# Altium project FMC_ADC_250M_16B_4ch.PrjPCB (part 4 of 4)

## Sheet ADC_Buffers.SchDoc
size A3
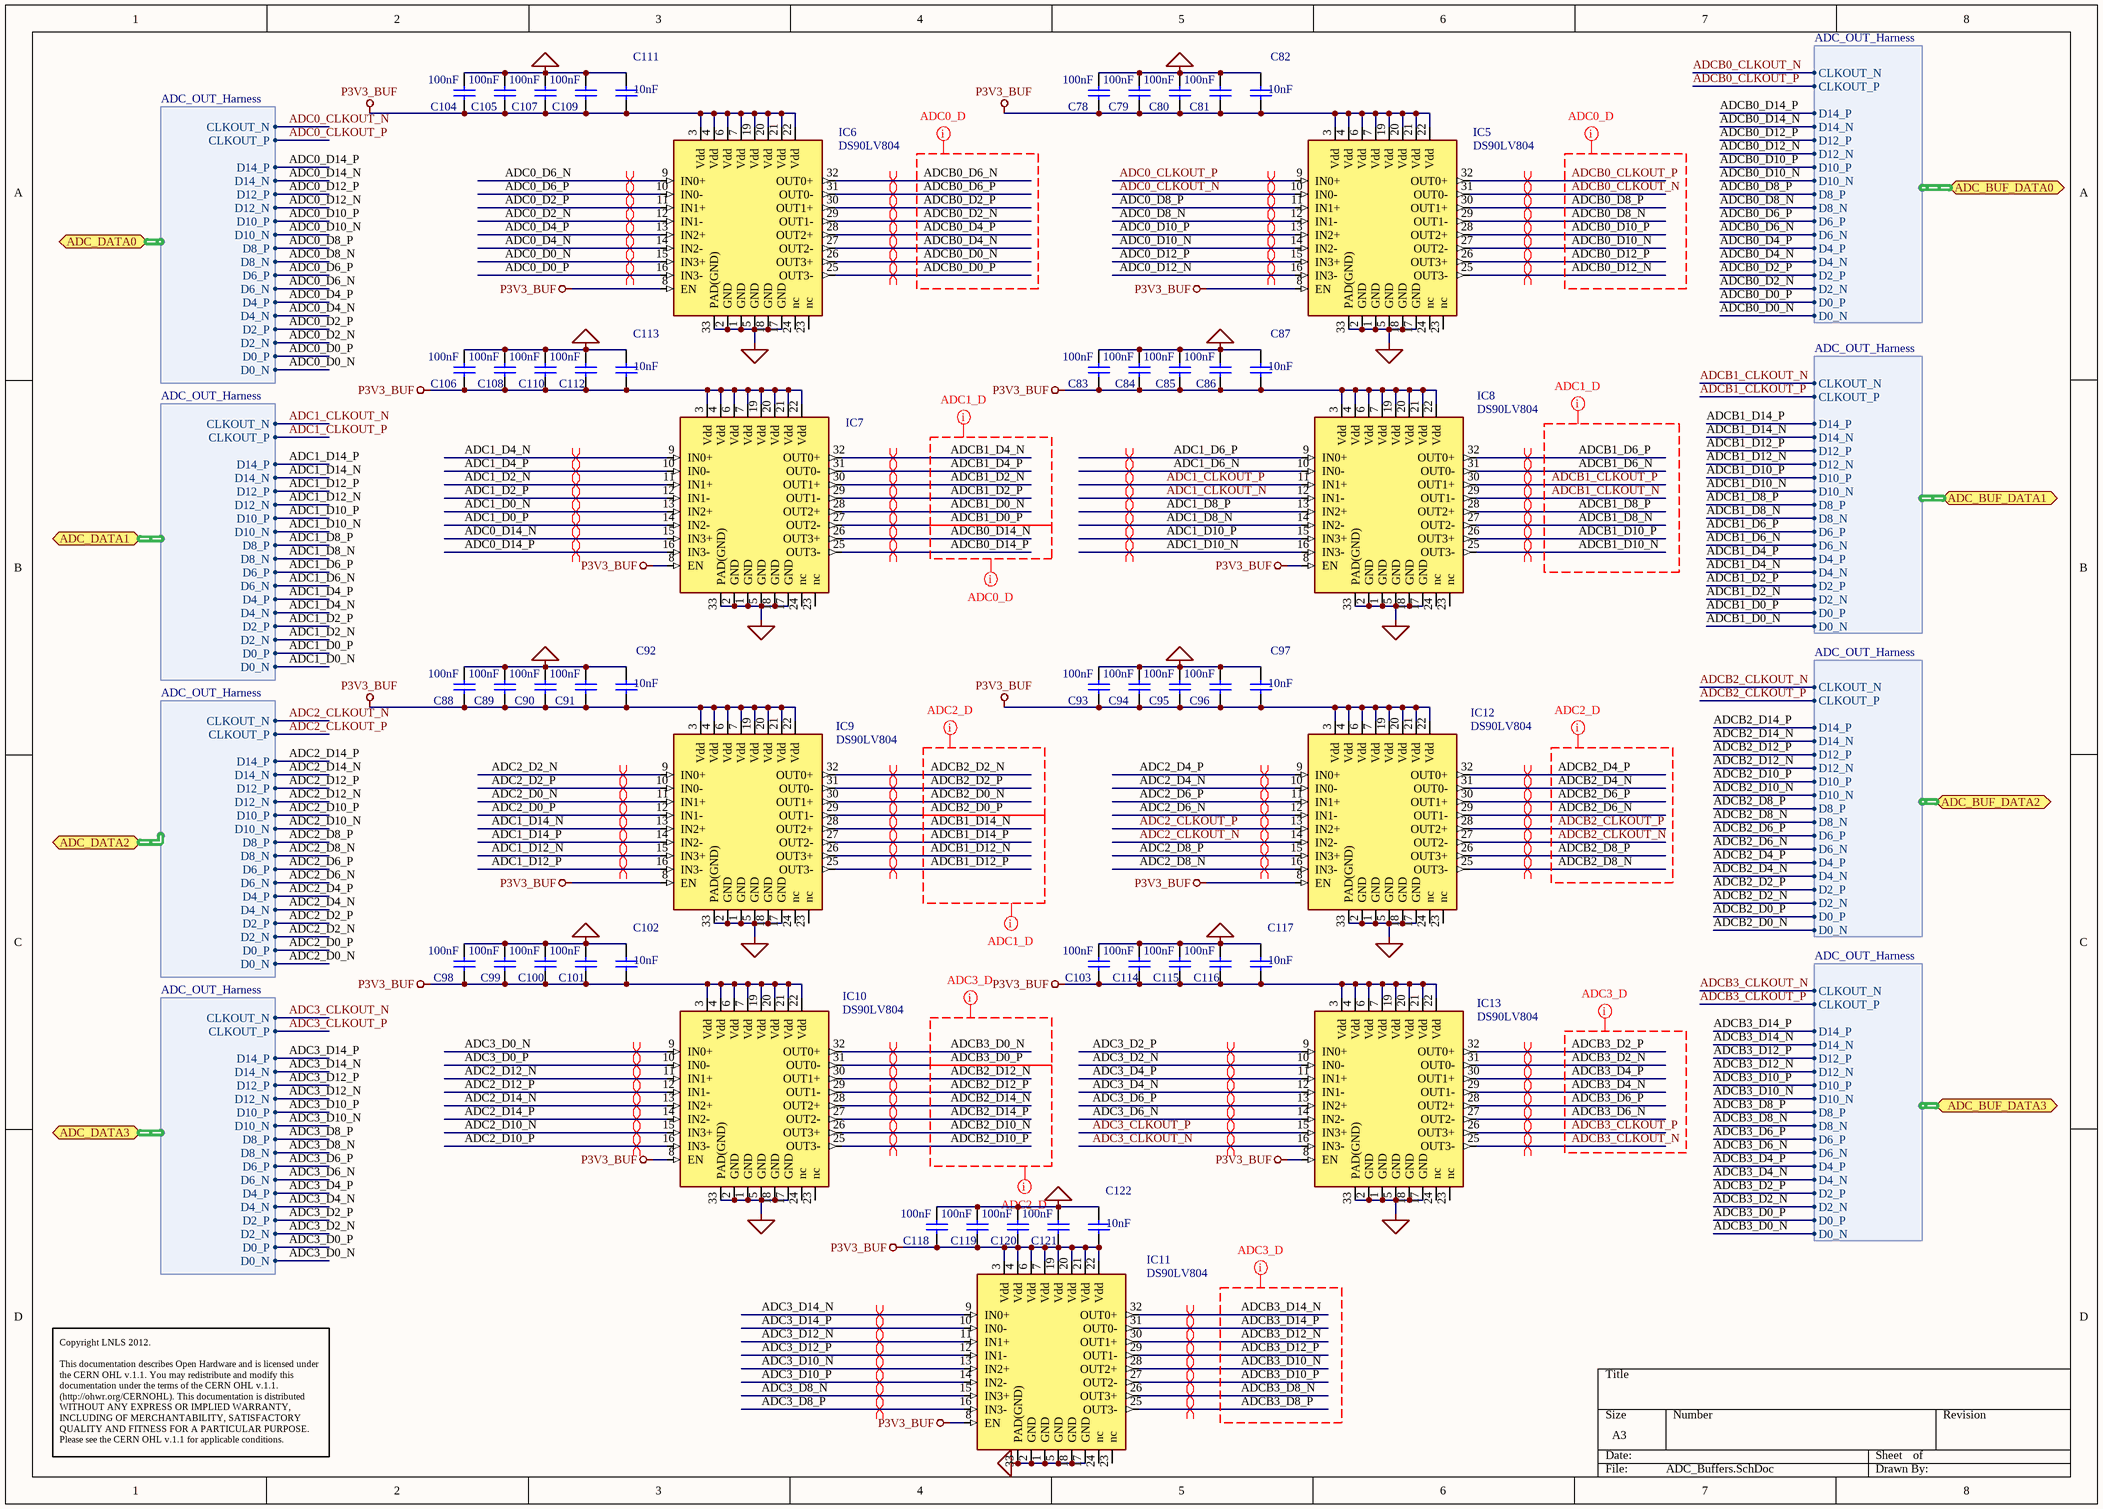
[diagram p6: ADC_Buffers.SchDoc]

### Parts
C78  100nF  [CAPC0603X33N]
C79  100nF  [CAPC0603X33N]
C80  100nF  [CAPC0603X33N]
C81  100nF  [CAPC0603X33N]
C82  10nF  [CAPC0603X33N]
C83  100nF  [CAPC0603X33N]
C84  100nF  [CAPC0603X33N]
C85  100nF  [CAPC0603X33N]
C86  100nF  [CAPC0603X33N]
C87  10nF  [CAPC0603X33N]
C88  100nF  [CAPC0603X33N]
C89  100nF  [CAPC0603X33N]
C90  100nF  [CAPC0603X33N]
C91  100nF  [CAPC0603X33N]
C92  10nF  [CAPC0603X33N]
C93  100nF  [CAPC0603X33N]
C94  100nF  [CAPC0603X33N]
C95  100nF  [CAPC0603X33N]
C96  100nF  [CAPC0603X33N]
C97  10nF  [CAPC0603X33N]
C98  100nF  [CAPC0603X33N]
C99  100nF  [CAPC0603X33N]
C100  100nF  [CAPC0603X33N]
C101  100nF  [CAPC0603X33N]
C102  10nF  [CAPC0603X33N]
C103  100nF  [CAPC0603X33N]
C104  100nF  [CAPC0603X33N]
C105  100nF  [CAPC0603X33N]
C106  100nF  [CAPC0603X33N]
C107  100nF  [CAPC0603X33N]
C108  100nF  [CAPC0603X33N]
C109  100nF  [CAPC0603X33N]
C110  100nF  [CAPC0603X33N]
C111  10nF  [CAPC0603X33N]
C112  100nF  [CAPC0603X33N]
C113  10nF  [CAPC0603X33N]
C114  100nF  [CAPC0603X33N]
C115  100nF  [CAPC0603X33N]
C116  100nF  [CAPC0603X33N]
C117  10nF  [CAPC0603X33N]
C118  100nF  [CAPC0603X33N]
C119  100nF  [CAPC0603X33N]
C120  100nF  [CAPC0603X33N]
C121  100nF  [CAPC0603X33N]
C122  10nF  [CAPC0603X33N]
IC5  DS90LV804  [QFN50P500X500X80-33N-S320]
IC6  DS90LV804  [QFN50P500X500X80-33N-S320]
IC7  DS90LV804  [QFN50P500X500X80-33N-S320]  (value not drawn)
IC8  DS90LV804  [QFN50P500X500X80-33N-S320]
IC9  DS90LV804  [QFN50P500X500X80-33N-S320]
IC10  DS90LV804  [QFN50P500X500X80-33N-S320]
IC11  DS90LV804  [QFN50P500X500X80-33N-S320]
IC12  DS90LV804  [QFN50P500X500X80-33N-S320]
IC13  DS90LV804  [QFN50P500X500X80-33N-S320]

### Ports
ADC_BUF_DATA0 (harness ADC_OUT_Harness), ADC_BUF_DATA1 (harness ADC_OUT_Harness), ADC_BUF_DATA2 (harness ADC_OUT_Harness), ADC_BUF_DATA3 (harness ADC_OUT_Harness), ADC_DATA0 (harness ADC_OUT_Harness), ADC_DATA1 (harness ADC_OUT_Harness), ADC_DATA2 (harness ADC_OUT_Harness), ADC_DATA3 (harness ADC_OUT_Harness)

### Harnesses
ADC_OUT_Harness: D14_P, D14_N, D12_P, D12_N, D10_P, D10_N, D8_P, D8_N, D6_P, D6_N, D4_P, D4_N, D2_P, D2_N, D0_P, D0_N, CLKOUT_N, CLKOUT_P

### Nets
GND: C78.1 C79.1 C80.1 C81.1 C82.1 C83.1 C84.1 C85.1 C86.1 C87.1 C88.1 C89.1 C90.1 C91.1 C92.1 C93.1 C94.1 C95.1 C96.1 C97.1 C98.1 C99.1 C100.1 C101.1 C102.1 C103.1 C104.1 C105.1 C106.1 C107.1 C108.1 C109.1 C110.1 C111.1 C112.1 C113.1 C114.1 C115.1 C116.1 C117.1 C118.1 C119.1 C120.1 C121.1 C122.1 IC5.1(GND) IC5.2(GND) IC5.5(GND) IC5.17(GND) IC5.18(GND) IC5.33(PAD(GND)) IC6.1(GND) IC6.2(GND) IC6.5(GND) IC6.17(GND) IC6.18(GND) IC6.33(PAD(GND)) IC7.1(GND) IC7.2(GND) IC7.5(GND) IC7.17(GND) IC7.18(GND) IC7.33(PAD(GND)) IC8.1(GND) IC8.2(GND) IC8.5(GND) IC8.17(GND) IC8.18(GND) IC8.33(PAD(GND)) IC9.1(GND) IC9.2(GND) IC9.5(GND) IC9.17(GND) IC9.18(GND) IC9.33(PAD(GND)) IC10.1(GND) IC10.2(GND) IC10.5(GND) IC10.17(GND) IC10.18(GND) IC10.33(PAD(GND)) IC11.1(GND) IC11.2(GND) IC11.5(GND) IC11.17(GND) IC11.18(GND) IC11.33(PAD(GND)) IC12.1(GND) IC12.2(GND) IC12.5(GND) IC12.17(GND) IC12.18(GND) IC12.33(PAD(GND)) IC13.1(GND) IC13.2(GND) IC13.5(GND) IC13.17(GND) IC13.18(GND) IC13.33(PAD(GND))
P3V3_BUF: C78.2 C79.2 C80.2 C81.2 C82.2 C83.2 C84.2 C85.2 C86.2 C87.2 C88.2 C89.2 C90.2 C91.2 C92.2 C93.2 C94.2 C95.2 C96.2 C97.2 C98.2 C99.2 C100.2 C101.2 C102.2 C103.2 C104.2 C105.2 C106.2 C107.2 C108.2 C109.2 C110.2 C111.2 C112.2 C113.2 C114.2 C115.2 C116.2 C117.2 C118.2 C119.2 C120.2 C121.2 C122.2 IC5.3(Vdd) IC5.4(Vdd) IC5.6(Vdd) IC5.7(Vdd) IC5.8(EN) IC5.19(Vdd) IC5.20(Vdd) IC5.21(Vdd) IC5.22(Vdd) IC6.3(Vdd) IC6.4(Vdd) IC6.6(Vdd) IC6.7(Vdd) IC6.8(EN) IC6.19(Vdd) IC6.20(Vdd) IC6.21(Vdd) IC6.22(Vdd) IC7.3(Vdd) IC7.4(Vdd) IC7.6(Vdd) IC7.7(Vdd) IC7.8(EN) IC7.19(Vdd) IC7.20(Vdd) IC7.21(Vdd) IC7.22(Vdd) IC8.3(Vdd) IC8.4(Vdd) IC8.6(Vdd) IC8.7(Vdd) IC8.8(EN) IC8.19(Vdd) IC8.20(Vdd) IC8.21(Vdd) IC8.22(Vdd) IC9.3(Vdd) IC9.4(Vdd) IC9.6(Vdd) IC9.7(Vdd) IC9.8(EN) IC9.19(Vdd) IC9.20(Vdd) IC9.21(Vdd) IC9.22(Vdd) IC10.3(Vdd) IC10.4(Vdd) IC10.6(Vdd) IC10.7(Vdd) IC10.8(EN) IC10.19(Vdd) IC10.20(Vdd) IC10.21(Vdd) IC10.22(Vdd) IC11.3(Vdd) IC11.4(Vdd) IC11.6(Vdd) IC11.7(Vdd) IC11.8(EN) IC11.19(Vdd) IC11.20(Vdd) IC11.21(Vdd) IC11.22(Vdd) IC12.3(Vdd) IC12.4(Vdd) IC12.6(Vdd) IC12.7(Vdd) IC12.8(EN) IC12.19(Vdd) IC12.20(Vdd) IC12.21(Vdd) IC12.22(Vdd) IC13.3(Vdd) IC13.4(Vdd) IC13.6(Vdd) IC13.7(Vdd) IC13.8(EN) IC13.19(Vdd) IC13.20(Vdd) IC13.21(Vdd) IC13.22(Vdd)
ADC0_CLKOUT_N: IC5.10(IN0-) ; port ADC_DATA0.CLKOUT_N  [project net ADC_DATA0.CLKOUT_N]
ADC0_CLKOUT_P: IC5.9(IN0+) ; port ADC_DATA0.CLKOUT_P  [project net ADC_DATA0.CLKOUT_P]
ADC0_D0_N: IC6.15(IN3+) ; port ADC_DATA0.D0_N  [project net ADC_DATA0.D0_N]
ADC0_D0_P: IC6.16(IN3-) ; port ADC_DATA0.D0_P  [project net ADC_DATA0.D0_P]
ADC0_D2_N: IC6.12(IN1-) ; port ADC_DATA0.D2_N  [project net ADC_DATA0.D2_N]
ADC0_D2_P: IC6.11(IN1+) ; port ADC_DATA0.D2_P  [project net ADC_DATA0.D2_P]
ADC0_D4_N: IC6.14(IN2-) ; port ADC_DATA0.D4_N  [project net ADC_DATA0.D4_N]
ADC0_D4_P: IC6.13(IN2+) ; port ADC_DATA0.D4_P  [project net ADC_DATA0.D4_P]
ADC0_D6_N: IC6.9(IN0+) ; port ADC_DATA0.D6_N  [project net ADC_DATA0.D6_N]
ADC0_D6_P: IC6.10(IN0-) ; port ADC_DATA0.D6_P  [project net ADC_DATA0.D6_P]
ADC0_D8_N: IC5.12(IN1-) ; port ADC_DATA0.D8_N  [project net ADC_DATA0.D8_N]
ADC0_D8_P: IC5.11(IN1+) ; port ADC_DATA0.D8_P  [project net ADC_DATA0.D8_P]
ADC0_D10_N: IC5.14(IN2-) ; port ADC_DATA0.D10_N  [project net ADC_DATA0.D10_N]
ADC0_D10_P: IC5.13(IN2+) ; port ADC_DATA0.D10_P  [project net ADC_DATA0.D10_P]
ADC0_D12_N: IC5.16(IN3-) ; port ADC_DATA0.D12_N  [project net ADC_DATA0.D12_N]
ADC0_D12_P: IC5.15(IN3+) ; port ADC_DATA0.D12_P  [project net ADC_DATA0.D12_P]
ADC0_D14_N: IC7.15(IN3+) ; port ADC_DATA0.D14_N  [project net ADC_DATA0.D14_N]
ADC0_D14_P: IC7.16(IN3-) ; port ADC_DATA0.D14_P  [project net ADC_DATA0.D14_P]
ADC1_CLKOUT_N: IC8.12(IN1-) ; port ADC_DATA1.CLKOUT_N  [project net ADC_DATA1.CLKOUT_N]
ADC1_CLKOUT_P: IC8.11(IN1+) ; port ADC_DATA1.CLKOUT_P  [project net ADC_DATA1.CLKOUT_P]
ADC1_D0_N: IC7.13(IN2+) ; port ADC_DATA1.D0_N  [project net ADC_DATA1.D0_N]
ADC1_D0_P: IC7.14(IN2-) ; port ADC_DATA1.D0_P  [project net ADC_DATA1.D0_P]
ADC1_D2_N: IC7.11(IN1+) ; port ADC_DATA1.D2_N  [project net ADC_DATA1.D2_N]
ADC1_D2_P: IC7.12(IN1-) ; port ADC_DATA1.D2_P  [project net ADC_DATA1.D2_P]
ADC1_D4_N: IC7.9(IN0+) ; port ADC_DATA1.D4_N  [project net ADC_DATA1.D4_N]
ADC1_D4_P: IC7.10(IN0-) ; port ADC_DATA1.D4_P  [project net ADC_DATA1.D4_P]
ADC1_D6_N: IC8.10(IN0-) ; port ADC_DATA1.D6_N  [project net ADC_DATA1.D6_N]
ADC1_D6_P: IC8.9(IN0+) ; port ADC_DATA1.D6_P  [project net ADC_DATA1.D6_P]
ADC1_D8_N: IC8.14(IN2-) ; port ADC_DATA1.D8_N  [project net ADC_DATA1.D8_N]
ADC1_D8_P: IC8.13(IN2+) ; port ADC_DATA1.D8_P  [project net ADC_DATA1.D8_P]
ADC1_D10_N: IC8.16(IN3-) ; port ADC_DATA1.D10_N  [project net ADC_DATA1.D10_N]
ADC1_D10_P: IC8.15(IN3+) ; port ADC_DATA1.D10_P  [project net ADC_DATA1.D10_P]
ADC1_D12_N: IC9.15(IN3+) ; port ADC_DATA1.D12_N  [project net ADC_DATA1.D12_N]
ADC1_D12_P: IC9.16(IN3-) ; port ADC_DATA1.D12_P  [project net ADC_DATA1.D12_P]
ADC1_D14_N: IC9.13(IN2+) ; port ADC_DATA1.D14_N  [project net ADC_DATA1.D14_N]
ADC1_D14_P: IC9.14(IN2-) ; port ADC_DATA1.D14_P  [project net ADC_DATA1.D14_P]
ADC2_CLKOUT_N: IC12.14(IN2-) ; port ADC_DATA2.CLKOUT_N  [project net ADC_DATA2.CLKOUT_N]
ADC2_CLKOUT_P: IC12.13(IN2+) ; port ADC_DATA2.CLKOUT_P  [project net ADC_DATA2.CLKOUT_P]
ADC2_D0_N: IC9.11(IN1+) ; port ADC_DATA2.D0_N  [project net ADC_DATA2.D0_N]
ADC2_D0_P: IC9.12(IN1-) ; port ADC_DATA2.D0_P  [project net ADC_DATA2.D0_P]
ADC2_D2_N: IC9.9(IN0+) ; port ADC_DATA2.D2_N  [project net ADC_DATA2.D2_N]
ADC2_D2_P: IC9.10(IN0-) ; port ADC_DATA2.D2_P  [project net ADC_DATA2.D2_P]
ADC2_D4_N: IC12.10(IN0-) ; port ADC_DATA2.D4_N  [project net ADC_DATA2.D4_N]
ADC2_D4_P: IC12.9(IN0+) ; port ADC_DATA2.D4_P  [project net ADC_DATA2.D4_P]
ADC2_D6_N: IC12.12(IN1-) ; port ADC_DATA2.D6_N  [project net ADC_DATA2.D6_N]
ADC2_D6_P: IC12.11(IN1+) ; port ADC_DATA2.D6_P  [project net ADC_DATA2.D6_P]
ADC2_D8_N: IC12.16(IN3-) ; port ADC_DATA2.D8_N  [project net ADC_DATA2.D8_N]
ADC2_D8_P: IC12.15(IN3+) ; port ADC_DATA2.D8_P  [project net ADC_DATA2.D8_P]
ADC2_D10_N: IC10.15(IN3+) ; port ADC_DATA2.D10_N  [project net ADC_DATA2.D10_N]
ADC2_D10_P: IC10.16(IN3-) ; port ADC_DATA2.D10_P  [project net ADC_DATA2.D10_P]
ADC2_D12_N: IC10.11(IN1+) ; port ADC_DATA2.D12_N  [project net ADC_DATA2.D12_N]
ADC2_D12_P: IC10.12(IN1-) ; port ADC_DATA2.D12_P  [project net ADC_DATA2.D12_P]
ADC2_D14_N: IC10.13(IN2+) ; port ADC_DATA2.D14_N  [project net ADC_DATA2.D14_N]
ADC2_D14_P: IC10.14(IN2-) ; port ADC_DATA2.D14_P  [project net ADC_DATA2.D14_P]
ADC3_CLKOUT_N: IC13.16(IN3-) ; port ADC_DATA3.CLKOUT_N  [project net ADC_DATA3.CLKOUT_N]
ADC3_CLKOUT_P: IC13.15(IN3+) ; port ADC_DATA3.CLKOUT_P  [project net ADC_DATA3.CLKOUT_P]
ADC3_D0_N: IC10.9(IN0+) ; port ADC_DATA3.D0_N  [project net ADC_DATA3.D0_N]
ADC3_D0_P: IC10.10(IN0-) ; port ADC_DATA3.D0_P  [project net ADC_DATA3.D0_P]
ADC3_D2_N: IC13.10(IN0-) ; port ADC_DATA3.D2_N  [project net ADC_DATA3.D2_N]
ADC3_D2_P: IC13.9(IN0+) ; port ADC_DATA3.D2_P  [project net ADC_DATA3.D2_P]
ADC3_D4_N: IC13.12(IN1-) ; port ADC_DATA3.D4_N  [project net ADC_DATA3.D4_N]
ADC3_D4_P: IC13.11(IN1+) ; port ADC_DATA3.D4_P  [project net ADC_DATA3.D4_P]
ADC3_D6_N: IC13.14(IN2-) ; port ADC_DATA3.D6_N  [project net ADC_DATA3.D6_N]
ADC3_D6_P: IC13.13(IN2+) ; port ADC_DATA3.D6_P  [project net ADC_DATA3.D6_P]
ADC3_D8_N: IC11.15(IN3+) ; port ADC_DATA3.D8_N  [project net ADC_DATA3.D8_N]
ADC3_D8_P: IC11.16(IN3-) ; port ADC_DATA3.D8_P  [project net ADC_DATA3.D8_P]
ADC3_D10_N: IC11.13(IN2+) ; port ADC_DATA3.D10_N  [project net ADC_DATA3.D10_N]
ADC3_D10_P: IC11.14(IN2-) ; port ADC_DATA3.D10_P  [project net ADC_DATA3.D10_P]
ADC3_D12_N: IC11.11(IN1+) ; port ADC_DATA3.D12_N  [project net ADC_DATA3.D12_N]
ADC3_D12_P: IC11.12(IN1-) ; port ADC_DATA3.D12_P  [project net ADC_DATA3.D12_P]
ADC3_D14_N: IC11.9(IN0+) ; port ADC_DATA3.D14_N  [project net ADC_DATA3.D14_N]
ADC3_D14_P: IC11.10(IN0-) ; port ADC_DATA3.D14_P  [project net ADC_DATA3.D14_P]
ADCB0_CLKOUT_N: IC5.31(OUT0-) ; port ADC_BUF_DATA0.CLKOUT_N  [project net ADC_BUF_DATA0.CLKOUT_N]
ADCB0_CLKOUT_P: IC5.32(OUT0+) ; port ADC_BUF_DATA0.CLKOUT_P  [project net ADC_BUF_DATA0.CLKOUT_P]
ADCB0_D0_N: IC6.26(OUT3+) ; port ADC_BUF_DATA0.D0_N  [project net ADC_BUF_DATA0.D0_N]
ADCB0_D0_P: IC6.25(OUT3-) ; port ADC_BUF_DATA0.D0_P  [project net ADC_BUF_DATA0.D0_P]
ADCB0_D2_N: IC6.29(OUT1-) ; port ADC_BUF_DATA0.D2_N  [project net ADC_BUF_DATA0.D2_N]
ADCB0_D2_P: IC6.30(OUT1+) ; port ADC_BUF_DATA0.D2_P  [project net ADC_BUF_DATA0.D2_P]
ADCB0_D4_N: IC6.27(OUT2-) ; port ADC_BUF_DATA0.D4_N  [project net ADC_BUF_DATA0.D4_N]
ADCB0_D4_P: IC6.28(OUT2+) ; port ADC_BUF_DATA0.D4_P  [project net ADC_BUF_DATA0.D4_P]
ADCB0_D6_N: IC6.32(OUT0+) ; port ADC_BUF_DATA0.D6_N  [project net ADC_BUF_DATA0.D6_N]
ADCB0_D6_P: IC6.31(OUT0-) ; port ADC_BUF_DATA0.D6_P  [project net ADC_BUF_DATA0.D6_P]
ADCB0_D8_N: IC5.29(OUT1-) ; port ADC_BUF_DATA0.D8_N  [project net ADC_BUF_DATA0.D8_N]
ADCB0_D8_P: IC5.30(OUT1+) ; port ADC_BUF_DATA0.D8_P  [project net ADC_BUF_DATA0.D8_P]
ADCB0_D10_N: IC5.27(OUT2-) ; port ADC_BUF_DATA0.D10_N  [project net ADC_BUF_DATA0.D10_N]
ADCB0_D10_P: IC5.28(OUT2+) ; port ADC_BUF_DATA0.D10_P  [project net ADC_BUF_DATA0.D10_P]
ADCB0_D12_N: IC5.25(OUT3-) ; port ADC_BUF_DATA0.D12_N  [project net ADC_BUF_DATA0.D12_N]
ADCB0_D12_P: IC5.26(OUT3+) ; port ADC_BUF_DATA0.D12_P  [project net ADC_BUF_DATA0.D12_P]
ADCB0_D14_N: IC7.26(OUT3+) ; port ADC_BUF_DATA0.D14_N  [project net ADC_BUF_DATA0.D14_N]
ADCB0_D14_P: IC7.25(OUT3-) ; port ADC_BUF_DATA0.D14_P  [project net ADC_BUF_DATA0.D14_P]
ADCB1_CLKOUT_N: IC8.29(OUT1-) ; port ADC_BUF_DATA1.CLKOUT_N  [project net ADC_BUF_DATA1.CLKOUT_N]
ADCB1_CLKOUT_P: IC8.30(OUT1+) ; port ADC_BUF_DATA1.CLKOUT_P  [project net ADC_BUF_DATA1.CLKOUT_P]
ADCB1_D0_N: IC7.28(OUT2+) ; port ADC_BUF_DATA1.D0_N  [project net ADC_BUF_DATA1.D0_N]
ADCB1_D0_P: IC7.27(OUT2-) ; port ADC_BUF_DATA1.D0_P  [project net ADC_BUF_DATA1.D0_P]
ADCB1_D2_N: IC7.30(OUT1+) ; port ADC_BUF_DATA1.D2_N  [project net ADC_BUF_DATA1.D2_N]
ADCB1_D2_P: IC7.29(OUT1-) ; port ADC_BUF_DATA1.D2_P  [project net ADC_BUF_DATA1.D2_P]
ADCB1_D4_N: IC7.32(OUT0+) ; port ADC_BUF_DATA1.D4_N  [project net ADC_BUF_DATA1.D4_N]
ADCB1_D4_P: IC7.31(OUT0-) ; port ADC_BUF_DATA1.D4_P  [project net ADC_BUF_DATA1.D4_P]
ADCB1_D6_N: IC8.31(OUT0-) ; port ADC_BUF_DATA1.D6_N  [project net ADC_BUF_DATA1.D6_N]
ADCB1_D6_P: IC8.32(OUT0+) ; port ADC_BUF_DATA1.D6_P  [project net ADC_BUF_DATA1.D6_P]
ADCB1_D8_N: IC8.27(OUT2-) ; port ADC_BUF_DATA1.D8_N  [project net ADC_BUF_DATA1.D8_N]
ADCB1_D8_P: IC8.28(OUT2+) ; port ADC_BUF_DATA1.D8_P  [project net ADC_BUF_DATA1.D8_P]
ADCB1_D10_N: IC8.25(OUT3-) ; port ADC_BUF_DATA1.D10_N  [project net ADC_BUF_DATA1.D10_N]
ADCB1_D10_P: IC8.26(OUT3+) ; port ADC_BUF_DATA1.D10_P  [project net ADC_BUF_DATA1.D10_P]
ADCB1_D12_N: IC9.26(OUT3+) ; port ADC_BUF_DATA1.D12_N  [project net ADC_BUF_DATA1.D12_N]
ADCB1_D12_P: IC9.25(OUT3-) ; port ADC_BUF_DATA1.D12_P  [project net ADC_BUF_DATA1.D12_P]
ADCB1_D14_N: IC9.28(OUT2+) ; port ADC_BUF_DATA1.D14_N  [project net ADC_BUF_DATA1.D14_N]
ADCB1_D14_P: IC9.27(OUT2-) ; port ADC_BUF_DATA1.D14_P  [project net ADC_BUF_DATA1.D14_P]
ADCB2_CLKOUT_N: IC12.27(OUT2-) ; port ADC_BUF_DATA2.CLKOUT_N  [project net ADC_BUF_DATA2.CLKOUT_N]
ADCB2_CLKOUT_P: IC12.28(OUT2+) ; port ADC_BUF_DATA2.CLKOUT_P  [project net ADC_BUF_DATA2.CLKOUT_P]
ADCB2_D0_N: IC9.30(OUT1+) ; port ADC_BUF_DATA2.D0_N  [project net ADC_BUF_DATA2.D0_N]
ADCB2_D0_P: IC9.29(OUT1-) ; port ADC_BUF_DATA2.D0_P  [project net ADC_BUF_DATA2.D0_P]
ADCB2_D2_N: IC9.32(OUT0+) ; port ADC_BUF_DATA2.D2_N  [project net ADC_BUF_DATA2.D2_N]
ADCB2_D2_P: IC9.31(OUT0-) ; port ADC_BUF_DATA2.D2_P  [project net ADC_BUF_DATA2.D2_P]
ADCB2_D4_N: IC12.31(OUT0-) ; port ADC_BUF_DATA2.D4_N  [project net ADC_BUF_DATA2.D4_N]
ADCB2_D4_P: IC12.32(OUT0+) ; port ADC_BUF_DATA2.D4_P  [project net ADC_BUF_DATA2.D4_P]
ADCB2_D6_N: IC12.29(OUT1-) ; port ADC_BUF_DATA2.D6_N  [project net ADC_BUF_DATA2.D6_N]
ADCB2_D6_P: IC12.30(OUT1+) ; port ADC_BUF_DATA2.D6_P  [project net ADC_BUF_DATA2.D6_P]
ADCB2_D8_N: IC12.25(OUT3-) ; port ADC_BUF_DATA2.D8_N  [project net ADC_BUF_DATA2.D8_N]
ADCB2_D8_P: IC12.26(OUT3+) ; port ADC_BUF_DATA2.D8_P  [project net ADC_BUF_DATA2.D8_P]
ADCB2_D10_N: IC10.26(OUT3+) ; port ADC_BUF_DATA2.D10_N  [project net ADC_BUF_DATA2.D10_N]
ADCB2_D10_P: IC10.25(OUT3-) ; port ADC_BUF_DATA2.D10_P  [project net ADC_BUF_DATA2.D10_P]
ADCB2_D12_N: IC10.30(OUT1+) ; port ADC_BUF_DATA2.D12_N  [project net ADC_BUF_DATA2.D12_N]
ADCB2_D12_P: IC10.29(OUT1-) ; port ADC_BUF_DATA2.D12_P  [project net ADC_BUF_DATA2.D12_P]
ADCB2_D14_N: IC10.28(OUT2+) ; port ADC_BUF_DATA2.D14_N  [project net ADC_BUF_DATA2.D14_N]
ADCB2_D14_P: IC10.27(OUT2-) ; port ADC_BUF_DATA2.D14_P  [project net ADC_BUF_DATA2.D14_P]
ADCB3_CLKOUT_N: IC13.25(OUT3-) ; port ADC_BUF_DATA3.CLKOUT_N  [project net ADC_BUF_DATA3.CLKOUT_N]
ADCB3_CLKOUT_P: IC13.26(OUT3+) ; port ADC_BUF_DATA3.CLKOUT_P  [project net ADC_BUF_DATA3.CLKOUT_P]
ADCB3_D0_N: IC10.32(OUT0+) ; port ADC_BUF_DATA3.D0_N  [project net ADC_BUF_DATA3.D0_N]
ADCB3_D0_P: IC10.31(OUT0-) ; port ADC_BUF_DATA3.D0_P  [project net ADC_BUF_DATA3.D0_P]
ADCB3_D2_N: IC13.31(OUT0-) ; port ADC_BUF_DATA3.D2_N  [project net ADC_BUF_DATA3.D2_N]
ADCB3_D2_P: IC13.32(OUT0+) ; port ADC_BUF_DATA3.D2_P  [project net ADC_BUF_DATA3.D2_P]
ADCB3_D4_N: IC13.29(OUT1-) ; port ADC_BUF_DATA3.D4_N  [project net ADC_BUF_DATA3.D4_N]
ADCB3_D4_P: IC13.30(OUT1+) ; port ADC_BUF_DATA3.D4_P  [project net ADC_BUF_DATA3.D4_P]
ADCB3_D6_N: IC13.27(OUT2-) ; port ADC_BUF_DATA3.D6_N  [project net ADC_BUF_DATA3.D6_N]
ADCB3_D6_P: IC13.28(OUT2+) ; port ADC_BUF_DATA3.D6_P  [project net ADC_BUF_DATA3.D6_P]
ADCB3_D8_N: IC11.26(OUT3+) ; port ADC_BUF_DATA3.D8_N  [project net ADC_BUF_DATA3.D8_N]
ADCB3_D8_P: IC11.25(OUT3-) ; port ADC_BUF_DATA3.D8_P  [project net ADC_BUF_DATA3.D8_P]
ADCB3_D10_N: IC11.28(OUT2+) ; port ADC_BUF_DATA3.D10_N  [project net ADC_BUF_DATA3.D10_N]
ADCB3_D10_P: IC11.27(OUT2-) ; port ADC_BUF_DATA3.D10_P  [project net ADC_BUF_DATA3.D10_P]
ADCB3_D12_N: IC11.30(OUT1+) ; port ADC_BUF_DATA3.D12_N  [project net ADC_BUF_DATA3.D12_N]
ADCB3_D12_P: IC11.29(OUT1-) ; port ADC_BUF_DATA3.D12_P  [project net ADC_BUF_DATA3.D12_P]
ADCB3_D14_N: IC11.32(OUT0+) ; port ADC_BUF_DATA3.D14_N  [project net ADC_BUF_DATA3.D14_N]
ADCB3_D14_P: IC11.31(OUT0-) ; port ADC_BUF_DATA3.D14_P  [project net ADC_BUF_DATA3.D14_P]

Not connected (* = marked no-connect by the designer): IC5 23(nc) 24(nc); IC6 23(nc) 24(nc); IC7 23(nc) 24(nc); IC8 23(nc) 24(nc); IC9 23(nc) 24(nc); IC10 23(nc) 24(nc); IC11 23(nc) 24(nc); IC12 23(nc) 24(nc); IC13 23(nc) 24(nc)

### Layout directives
differential pair: ADC_BUF_DATA0.CLKOUT_N, ADC_BUF_DATA0.CLKOUT_P, ADC_BUF_DATA0.D0_N, ADC_BUF_DATA0.D0_P, ADC_BUF_DATA0.D2_N, ADC_BUF_DATA0.D2_P, ADC_BUF_DATA0.D4_N, ADC_BUF_DATA0.D4_P, ADC_BUF_DATA0.D6_N, ADC_BUF_DATA0.D6_P, ADC_BUF_DATA0.D8_N, ADC_BUF_DATA0.D8_P, ADC_BUF_DATA0.D10_N, ADC_BUF_DATA0.D10_P, ADC_BUF_DATA0.D12_N, ADC_BUF_DATA0.D12_P, ADC_BUF_DATA0.D14_N, ADC_BUF_DATA0.D14_P, ADC_BUF_DATA1.CLKOUT_N, ADC_BUF_DATA1.CLKOUT_P, ADC_BUF_DATA1.D0_N, ADC_BUF_DATA1.D0_P, ADC_BUF_DATA1.D2_N, ADC_BUF_DATA1.D2_P, ADC_BUF_DATA1.D4_N, ADC_BUF_DATA1.D4_P, ADC_BUF_DATA1.D6_N, ADC_BUF_DATA1.D6_P, ADC_BUF_DATA1.D8_N, ADC_BUF_DATA1.D8_P, ADC_BUF_DATA1.D10_N, ADC_BUF_DATA1.D10_P, ADC_BUF_DATA1.D12_N, ADC_BUF_DATA1.D12_P, ADC_BUF_DATA1.D14_N, ADC_BUF_DATA1.D14_P, ADC_BUF_DATA2.CLKOUT_N, ADC_BUF_DATA2.CLKOUT_P, ADC_BUF_DATA2.D0_N, ADC_BUF_DATA2.D0_P, ADC_BUF_DATA2.D2_N, ADC_BUF_DATA2.D2_P, ADC_BUF_DATA2.D4_N, ADC_BUF_DATA2.D4_P, ADC_BUF_DATA2.D6_N, ADC_BUF_DATA2.D6_P, ADC_BUF_DATA2.D8_N, ADC_BUF_DATA2.D8_P, ADC_BUF_DATA2.D10_N, ADC_BUF_DATA2.D10_P, ADC_BUF_DATA2.D12_N, ADC_BUF_DATA2.D12_P, ADC_BUF_DATA2.D14_N, ADC_BUF_DATA2.D14_P, ADC_BUF_DATA3.CLKOUT_N, ADC_BUF_DATA3.CLKOUT_P, ADC_BUF_DATA3.D0_N, ADC_BUF_DATA3.D0_P, ADC_BUF_DATA3.D2_N, ADC_BUF_DATA3.D2_P, ADC_BUF_DATA3.D4_N, ADC_BUF_DATA3.D4_P, ADC_BUF_DATA3.D6_N, ADC_BUF_DATA3.D6_P, ADC_BUF_DATA3.D8_N, ADC_BUF_DATA3.D8_P, ADC_BUF_DATA3.D10_N, ADC_BUF_DATA3.D10_P, ADC_BUF_DATA3.D12_N, ADC_BUF_DATA3.D12_P, ADC_BUF_DATA3.D14_N, ADC_BUF_DATA3.D14_P, ADC_DATA0.CLKOUT_N, ADC_DATA0.CLKOUT_P, ADC_DATA0.D0_N, ADC_DATA0.D0_P, ADC_DATA0.D2_N, ADC_DATA0.D2_P, ADC_DATA0.D4_N, ADC_DATA0.D4_P, ADC_DATA0.D6_N, ADC_DATA0.D6_P, ADC_DATA0.D8_N, ADC_DATA0.D8_P, ADC_DATA0.D10_N, ADC_DATA0.D10_P, ADC_DATA0.D12_N, ADC_DATA0.D12_P, ADC_DATA0.D14_N, ADC_DATA0.D14_P, ADC_DATA1.CLKOUT_N, ADC_DATA1.CLKOUT_P, ADC_DATA1.D0_N, ADC_DATA1.D0_P, ADC_DATA1.D2_N, ADC_DATA1.D2_P, ADC_DATA1.D4_N, ADC_DATA1.D4_P, ADC_DATA1.D6_N, ADC_DATA1.D6_P, ADC_DATA1.D8_N, ADC_DATA1.D8_P, ADC_DATA1.D10_N, ADC_DATA1.D10_P, ADC_DATA1.D12_N, ADC_DATA1.D12_P, ADC_DATA1.D14_N, ADC_DATA1.D14_P, ADC_DATA2.CLKOUT_N, ADC_DATA2.CLKOUT_P, ADC_DATA2.D0_N, ADC_DATA2.D0_P, ADC_DATA2.D2_N, ADC_DATA2.D2_P, ADC_DATA2.D4_N, ADC_DATA2.D4_P, ADC_DATA2.D6_N, ADC_DATA2.D6_P, ADC_DATA2.D8_N, ADC_DATA2.D8_P, ADC_DATA2.D10_N, ADC_DATA2.D10_P, ADC_DATA2.D12_N, ADC_DATA2.D12_P, ADC_DATA2.D14_N, ADC_DATA2.D14_P, ADC_DATA3.CLKOUT_N, ADC_DATA3.CLKOUT_P, ADC_DATA3.D0_N, ADC_DATA3.D0_P, ADC_DATA3.D2_N, ADC_DATA3.D2_P, ADC_DATA3.D4_N, ADC_DATA3.D4_P, ADC_DATA3.D6_N, ADC_DATA3.D6_P, ADC_DATA3.D8_N, ADC_DATA3.D8_P, ADC_DATA3.D10_N, ADC_DATA3.D10_P, ADC_DATA3.D12_N, ADC_DATA3.D12_P, ADC_DATA3.D14_N, ADC_DATA3.D14_P
net class ADC2_D: ADCB2_CLKOUT_N, ADCB2_CLKOUT_P, ADCB2_D0_N, ADCB2_D0_P, ADCB2_D2_N, ADCB2_D2_P, ADCB2_D4_N, ADCB2_D4_P, ADCB2_D6_N, ADCB2_D6_P, ADCB2_D8_N, ADCB2_D8_P, ADCB2_D10_N, ADCB2_D10_P, ADCB2_D12_N, ADCB2_D12_P, ADCB2_D14_N, ADCB2_D14_P, ADCB3_D0_P
net class ADC0_D: ADCB0_CLKOUT_N, ADCB0_CLKOUT_P, ADCB0_D0_N, ADCB0_D0_P, ADCB0_D2_N, ADCB0_D2_P, ADCB0_D4_N, ADCB0_D4_P, ADCB0_D6_N, ADCB0_D6_P, ADCB0_D8_N, ADCB0_D8_P, ADCB0_D10_N, ADCB0_D10_P, ADCB0_D12_N, ADCB0_D12_P, ADCB0_D14_N, ADCB0_D14_P, ADCB1_D0_P
net class ADC1_D: ADCB1_CLKOUT_N, ADCB1_CLKOUT_P, ADCB1_D0_N, ADCB1_D0_P, ADCB1_D2_N, ADCB1_D2_P, ADCB1_D4_N, ADCB1_D4_P, ADCB1_D6_N, ADCB1_D6_P, ADCB1_D8_N, ADCB1_D8_P, ADCB1_D10_N, ADCB1_D10_P, ADCB1_D12_N, ADCB1_D12_P, ADCB1_D14_N, ADCB1_D14_P, ADCB2_D0_P
net class ADC3_D: ADCB3_CLKOUT_N, ADCB3_CLKOUT_P, ADCB3_D0_N, ADCB3_D0_P, ADCB3_D2_N, ADCB3_D2_P, ADCB3_D4_N, ADCB3_D4_P, ADCB3_D6_N, ADCB3_D6_P, ADCB3_D8_N, ADCB3_D8_P, ADCB3_D10_N, ADCB3_D10_P, ADCB3_D12_N, ADCB3_D12_P, ADCB3_D14_N, ADCB3_D14_P

### Notes on the sheet
- Copyright LNLS 2012.
  This documentation describes Open Hardware and is licensed under the CERN OHL v.1.1. You may redistribute and modify this documentation under the terms of the CERN OHL v.1.1. (http://ohwr.org/CERNOHL). This documentation is distributed WITHOUT ANY EXPRESS OR IMPLIED WARRANTY, INCLUDING OF MERCHANTABILITY, SATISFACTORY QUALITY AND FITNESS FOR A PARTICULAR PURPOSE. Please see the CERN OHL v.1.1 for applicable conditions.

### Library data of the parts
C78-C81 C83-C86 C88-C91 C93-C96 C98-C101 C103-C110 C112 C114-C116 C118-C121 = CC0201_100NF_6.3V_10%_X5R: Non-polarised capacitor; Part Description: SMD Multilayer Chip Ceramic Capacitor; Manufacturer: GENERIC; Manufacturer1 Part Number: 02016D104KAT2A; Voltage: 6.3V; TC: X5R; Tolerance: ±10%; Table: Capacitors SMD; Value: 100nF; Part Number: CC0201_100NF_6.3V_10%_X5R; Component Kind: Standard; Component Type: Standard; Pin Count: 2; Status: Not Recommended; Manufacturer Part Number: CC0201_100NF_6.3V_10%_X5R; Case: 0201; Mounted: Yes; Socket: No; SMD: Yes; Manufacturer1 Example: AVX; Manufacturer1 ComponentHeight: 0.33mm; HelpURL: \\cern.ch\dfs\Applications\Altium\Datasheets\CC0201_X5R_AVX.pdf; Author: CERN DEM JLC; CreateDate: 03/12/2007; LatestRevisionDate: 03/12/2007; Sense: No
C82 C87 C92 C97 C102 C111 C113 C117 C122 = CC0201_10NF_10V_10%_X7R: Non-polarised capacitor; Part Description: SMD Multilayer Chip Ceramic Capacitor; Manufacturer: GENERIC; Manufacturer1 Part Number: GRM033R71A103KA01D; Voltage: 10V; TC: X7R; Tolerance: ±10%; Value: 10nF; Part Number: CC0201_10NF_10V_10%_X7R; Component Kind: Standard; Component Type: Standard; Pin Count: 2; Status: Not Recommended; Manufacturer Part Number: CC0201_10NF_10V_10%_X7R; Case: 0201; Mounted: Yes; Socket: No; SMD: Yes; Manufacturer1 Example: Murata; Manufacturer1 ComponentHeight: 0.33mm; Author: LNLS DIG GBMB; CreateDate: 14/06/2016; LatestRevisionDate: 14/06/2016; Sense: No
IC5 IC6 = DS90LV804TSQ: 4-Channel 800 Mbps LVDS Buffer/Repeater; Manufacturer: TEXAS INSTRUMENTS; Bonding: No; PressFit: No; Part Number: DS90LV804TSQ; Author: LNLS DIG GBMB; Case: QFN32; ComponentHeight: 0.8mm; Component Type: Standard; CreateDate: 01/06/2016; Device: DS90LV804; LatestRevisionDate: 01/06/2016; Manufacturer Part Number: DS90LV804TSQ; Mounted: Yes; PackageDescription: QFN, 0.50mm Pitch, Square; 8 Pin X 8 Pin, 5mm X 5mm X 0.8mm H Body (w/Thermal Tab 3.2 X 3.2mm),  IPC Medium Density; Part Description: 4-Channel 800Mbps LVDS Buffer/Repeater; Pin Count: 33; Sense: No; SMD: Yes; Socket: No; Component Kind: Standard
IC7-IC13 = DS90LV804TSQ: 4-Channel 800 Mbps LVDS Buffer/Repeater; Manufacturer: TEXAS INSTRUMENTS; PressFit: No; Bonding: No; Part Number: DS90LV804TSQ; Component Kind: Standard; Component Type: Standard; Device: DS90LV804; PackageDescription: QFN, 0.50mm Pitch, Square; 8 Pin X 8 Pin, 5mm X 5mm X 0.8mm H Body (w/Thermal Tab 3.2 X 3.2mm),  IPC Medium Density; Part Description: 4-Channel 800Mbps LVDS Buffer/Repeater; Manufacturer Part Number: DS90LV804TSQ; Pin Count: 33; Case: QFN32; Mounted: Yes; Socket: No; SMD: Yes; Sense: No; ComponentHeight: 0.8mm; Author: LNLS DIG GBMB; CreateDate: 01/06/2016; LatestRevisionDate: 01/06/2016

## Sheet Triggers.SchDoc
size A4
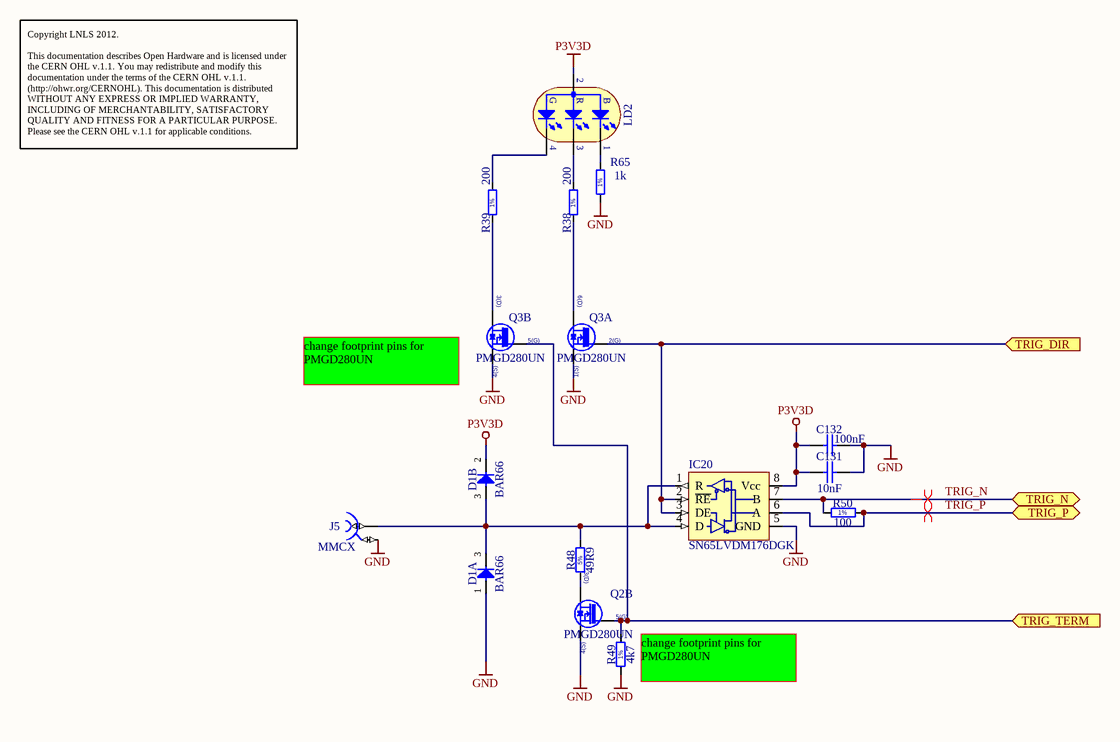
[diagram p7: Triggers.SchDoc]

### Parts
C131  10nF  [CAPC0603X33N]
C132  100nF  [CAPC0603X33N]
D1  BAR66  [SOT95P240X110-3N]  (parts A,B of 2)
IC20  SN65LVDM176DGK  [SOP65P490X110-8N]
J5  MMCX  [HUBER-SUHNER_85_MMCX-50-0-1/111_OH]
LD2  (no value)  [LED_AVAGO_HSMF-C113]
Q2  PMGD280UN  [SOT65P210X110-6N]  (part B of 2)
Q3  PMGD280UN  [SOT65P210X110-6N]  (parts A,B of 2)
R38  200  [RESC1005X40N]
R39  200  [RESC1005X40N]
R48  49R9  [RESC3225X70N]
R49  4k7  [RESC1005X40N]
R50  100  [RESC1005X40N]
R65  1k  [RESC1005X40N]

### Ports
TRIG_DIR (in), TRIG_N (bidir), TRIG_P (bidir), TRIG_TERM (in)

### Nets
GND: C131.2 C132.2 D1.1(A) IC20.5(GND) J5.2 Q2.4(S) Q3.1(S) Q3.4(S) R49.1 R65.1
P3V3D: C131.1 C132.1 D1.2(C) IC20.8(Vcc) LD2.2(AC)
TRIG_DIR: IC20.2(~{RE}) IC20.3(DE) Q3.2(G) ; port TRIG_DIR
TRIG_N: IC20.7(B) R50.1 ; port TRIG_N  [project net LA33_N]
TRIG_P: IC20.6(A) R50.2 ; port TRIG_P  [project net LA33_P]
TRIG_TERM: Q2.5(G) Q3.5(G) R49.2 ; port TRIG_TERM
NetD1_3: D1.3(COMAC) IC20.1(R) IC20.4(D) J5.1 R48.2
NetLD2_1: LD2.1(CB) R65.2
NetLD2_3: LD2.3(CR) R38.2
NetLD2_4: LD2.4(CG) R39.2
NetQ2_3: Q2.3(D) R48.1
NetQ3_3: Q3.3(D) R39.1
NetQ3_6: Q3.6(D) R38.1

### Layout directives
differential pair: LA33_N, LA33_P

### Notes on the sheet
- Copyright LNLS 2012.
  This documentation describes Open Hardware and is licensed under the CERN OHL v.1.1. You may redistribute and modify this documentation under the terms of the CERN OHL v.1.1. (http://ohwr.org/CERNOHL). This documentation is distributed WITHOUT ANY EXPRESS OR IMPLIED WARRANTY, INCLUDING OF MERCHANTABILITY, SATISFACTORY QUALITY AND FITNESS FOR A PARTICULAR PURPOSE. Please see the CERN OHL v.1.1 for applicable conditions.
- (near Q3) change footprint pins for PMGD280UN
- (near R49) change footprint pins for PMGD280UN
- (in symbol LED_AVAGO_HSMF-C113) G; R; B
- (in symbol PMGD280UN, part A) 6(D); 2(G); 1(S)
- (in symbol PMGD280UN, part B) 3(D); 5(G); 4(S)
- (in symbol R0402_1K_1%_0.0625W_100PPM) 1%
- (in symbol R0402_4K7_1%_0.0625W_100PPM) 1%
- (in symbol R0402_100R_1%_0.0625W_100PPM) 1%
- (in symbol R0402_200R_1%_0.0625W_100PPM) 1%
- (in symbol R1210_270R_5%_0.5W_200PPM) 5%

### Library data of the parts
C131 = CC0201_10NF_10V_10%_X7R: as C82 on sheet ADC_Buffers; Part Number: CC0201_10NF_10V_10%_X7R; Component Kind: Standard; Component Type: Standard; Pin Count: 2; Value: 10nF; Status: None; Manufacturer Part Number: CC0201_10NF_10V_10%_X7R; Case: 0201; Mounted: Yes; Socket: No; SMD: Yes; Manufacturer1 Example: Murata; Manufacturer1 ComponentHeight: 0.33mm; Author: LNLS DIG GBMB; CreateDate: 14/06/2016; LatestRevisionDate: 14/06/2016; Sense: No
C132 = CC0201_100NF_6.3V_10%_X5R: as C78 on sheet ADC_Buffers; Part Number: CC0201_100NF_6.3V_10%_X5R; Component Kind: Standard; Component Type: Standard; Pin Count: 2; Value: 100nF; Status: Not Recommended; Manufacturer Part Number: CC0201_100NF_6.3V_10%_X5R; Case: 0201; Mounted: Yes; Socket: No; SMD: Yes; Manufacturer1 Example: AVX; Manufacturer1 ComponentHeight: 0.33mm; HelpURL: \\cern.ch\dfs\Applications\Altium\Datasheets\CC0201_X5R_AVX.pdf; Author: CERN DEM JLC; CreateDate: 03/12/2007; LatestRevisionDate: 03/12/2007; Sense: No
D1 = BAR66: Serial Diode; Part Description: Silicon PIN Diode Array (Series Connected); Manufacturer: INFINEON; Voltage: 150V; Power: 250mA; PressFit: No; Bonding: No; Part Number: BAR66; Component Kind: Standard; Component Type: Standard; Device: BAR66; PackageDescription: SOT23 3-Leads, Pitch 0.95mm - Body 1.3x2.9mm, IPC Medium Density; Manufacturer Part Number: BAR66; Pin Count: 3; Mounted: Yes; Socket: No; SMD: Yes; ComponentHeight: 1.1mm; HelpURL: \\cern.ch\dfs\Applications\Altium\Datasheets\BAR66.pdf; Author: CERN DEM JLC; CreateDate: 18/01/2010; LatestRevisionDate: 05/10/2010; Case: SOT23; Sense: No
IC20 = SN65LVDM176DGK: Differential Bus Transceiver; Part Description: High Speed Differential Transceiver LVDS/LVTTL; Manufacturer: TEXAS INSTRUMENTS; PressFit: No; Bonding: No; Part Number: SN65LVDM176DGK; Component Kind: Standard; Component Type: Standard; Device: SN65LVDM176DGK; PackageDescription: SOP, 0.65mm pitch; 8 pin, 3.00mm W X 3.00mm L X 1.10mm H body, IPC Medium Density; Manufacturer Part Number: SN65LVDM176DGK; Pin Count: 8; Case: SOP8; Mounted: Yes; Socket: No; SMD: Yes; Sense: No; ComponentHeight: 1.1mm; Author: LNLS DIG GBMB; CreateDate: 28/05/2016; LatestRevisionDate: 28/05/2016
J5 = HUBER-SUHNER_85_MMCX-50-0-1/111_OH: Part Description: MMCX 50 Ohms Right Angle PCB Jack; Manufacturer: HUBER+SUHNER; PressFit: No; Part Number: HUBER-SUHNER_85_MMCX-50-0-1/111_OH; Component Kind: Standard; Component Type: Standard; Pin Count: 2; Family: MMCX; Mounted: Yes; Socket: No; SMD: No; Status: None; Manufacturer Part Number: 85_MMCX-50-0-1/111_OH; ComponentHeight: 9.6mm; HelpURL: \\cern.ch\dfs\Applications\Altium\Datasheets\HUBER-SUHNER_85_MMCX-50-0-1-111_OH.pdf; Author: CERN DEM JLC; CreateDate: 04/10/2011; LatestRevisionDate: 06/11/2014; Sense: No
LD2 = LED_AVAGO_HSMF-C113: Tricolor LEDs 1 Cathode Blue, 2 Common Anode, 3 Cathode Red, 4 Cathode Green; Part Description: Right Angle Tricolor (Blue, Red, Green) Surface Mount ChipLED; Manufacturer: AVAGO TECHNOLOGIES; Color: Blue/Red/Green; Table: LEDs & Displays; Bonding: No; PressFit: No; Part Number: LED_AVAGO_HSMF-C113; Component Kind: Standard; Component Type: Standard; PackageDescription: Right Angle Tricolor Surface Mount ChipLED, Body 2.5x1mm; Manufacturer Part Number: HSMF-C113; Pin Count: 4; Mounted: Yes; Socket: No; SMD: Yes; ComponentHeight: 1mm; HelpURL: \\cern.ch\dfs\Applications\Altium\Datasheets\LED_AVAGO_HSMF-C113.pdf; Author: CERN DEM JLC; CreateDate: 29/09/2010; LatestRevisionDate: 29/09/2010; Sense: No
Q2 Q3 = PMGD280UN: Dual N-Channel micro TrenchMOS™ Ultra Low Level FET; Manufacturer: NXP SEMICONDUCTORS; Part Description: 20V 870mA Dual N-Channel micro TrenchMOS™ Ultra Low Level FET; Bonding: No; PressFit: No; Part Number: PMGD280UN; Author: CERN DEM JLC; Case: SOT363; ComponentHeight: 1.1mm; Component Type: Standard; CreateDate: 19/11/2014; Device: PMGD280UN; HelpURL: \\cern.ch\dfs\Applications\Altium\Datasheets\PMGD280UN.pdf; LatestRevisionDate: 19/11/2014; Manufacturer Part Number: PMGD280UN; Mounted: Yes; PackageDescription: SOT363, SC70-6, SOT, 0.65mm Pitch, 6 pin, 1.25mm W X 2.00mm L X 1.10mm H, IPC Medium Density; Pin Count: 6; Sense: No; SMD: Yes; Socket: No
R38 R39 = R0402_200R_1%_0.0625W_100PPM: Resistor - 1%; Part Description: General Purpose Thick Film Chip Resistor; Manufacturer: GENERIC; Manufacturer1 Part Number: 232270672001L; TC: ±100ppm/°C; Table: Resistors SMD; Part Number: R0402_200R_1%_0.0625W_100PPM; Component Kind: Standard; Component Type: Standard; Pin Count: 2; Value: 200; Status: Not recommended; Power: 0.0625W; Tolerance: ±1%; Manufacturer Part Number: R0402_200R_1%_0.0625W_100PPM; Case: 0402; Mounted: Yes; Socket: No; SMD: Yes; Manufacturer1 Example: YAGEO PHYCOMP; Manufacturer1 ComponentHeight: 0.4mm; HelpURL: \\cern.ch\dfs\Applications\Altium\Datasheets\R0402_Phycomp_RC0402.pdf; Author: CERN DEM JLC; CreateDate: 03/12/2007; LatestRevisionDate: 17/10/2012; Sense: No
R48 = R1210_270R_5%_0.5W_200PPM: Resistor - 5%; Part Number: R1210_49R9_1%_0.33W_100PPM; Part Description: General Purpose Thick Film Chip Resistor; Manufacturer: VISHAY; Manufacturer Part Number: CRCW121049R9FK; Power: 0.33W; TC: ±100ppm/°C; Table: Resistors SMD; Component Kind: Standard; Component Type: Standard; Pin Count: 2; Value: 49R9; Status: None; Tolerance: ±5%; Case: 1210; Mounted: Yes; Socket: No; SMD: Yes; ComponentHeight: 0.7mm; HelpURL: \\cern.ch\dfs\Applications\Altium\Datasheets\R1210_PANASONIC_ERJ.pdf; Author: CERN DEM JLC; CreateDate: 2011-10-26; LatestRevisionDate: 2011-10-26
R49 = R0402_4K7_1%_0.0625W_100PPM: Resistor - 1%; Part Description: General Purpose Thick Film Chip Resistor; Manufacturer: GENERIC; Manufacturer1 Part Number: 232270674702L; TC: ±100ppm/°C; Table: Resistors SMD; Part Number: R0402_4K7_1%_0.0625W_100PPM; Component Kind: Standard; Component Type: Standard; Pin Count: 2; Value: 4k7; Status: Not recommended; Power: 0.0625W; Tolerance: ±1%; Manufacturer Part Number: R0402_4K7_1%_0.0625W_100PPM; Case: 0402; Mounted: Yes; Socket: No; SMD: Yes; Manufacturer1 Example: YAGEO PHYCOMP; Manufacturer1 ComponentHeight: 0.4mm; HelpURL: \\cern.ch\dfs\Applications\Altium\Datasheets\R0402_Phycomp_RC0402.pdf; Author: CERN DEM JLC; CreateDate: 03/12/2007; LatestRevisionDate: 17/10/2012; Sense: No
R50 = R0402_100R_1%_0.0625W_100PPM: Resistor - 1%; Part Description: General Purpose Thick Film Chip Resistor; Manufacturer: GENERIC; Manufacturer1 Part Number: 232270671001L; TC: ±100ppm/°C; Table: Resistors SMD; Part Number: R0402_100R_1%_0.0625W_100PPM; Component Kind: Standard; Component Type: Standard; Pin Count: 2; Value: 100; Status: Not recommended; Power: 0.0625W; Tolerance: ±1%; Manufacturer Part Number: R0402_100R_1%_0.0625W_100PPM; Case: 0402; Mounted: Yes; Socket: No; SMD: Yes; Manufacturer1 Example: YAGEO PHYCOMP; Manufacturer1 ComponentHeight: 0.4mm; HelpURL: \\cern.ch\dfs\Applications\Altium\Datasheets\R0402_Phycomp_RC0402.pdf; Author: CERN DEM JLC; CreateDate: 03/12/2007; LatestRevisionDate: 17/10/2012; Sense: No
R65 = R0402_1K_1%_0.0625W_100PPM: Resistor - 1%; Part Description: General Purpose Thick Film Chip Resistor; Manufacturer: GENERIC; Manufacturer1 Part Number: 232270671002L; TC: ±100ppm/°C; Table: Resistors SMD; Part Number: R0402_1K_1%_0.0625W_100PPM; Component Kind: Standard; Component Type: Standard; Pin Count: 2; Value: 1k; Status: Not recommended; Power: 0.0625W; Tolerance: ±1%; Manufacturer Part Number: R0402_1K_1%_0.0625W_100PPM; Case: 0402; Mounted: Yes; Socket: No; SMD: Yes; Manufacturer1 Example: YAGEO PHYCOMP; Manufacturer1 ComponentHeight: 0.4mm; HelpURL: \\cern.ch\dfs\Applications\Altium\Datasheets\R0402_Phycomp_RC0402.pdf; Author: CERN DEM JLC; CreateDate: 03/12/2007; LatestRevisionDate: 17/10/2012; Sense: No

## Nets that join several sheets
3P3VAUX: EEPROM_Temp_LEDs (C55.2 IC22.8), FMC_connector (J6.d32)
GND: FMC_ADC_top (21 pins), EEPROM_Temp_LEDs (14 pins), FMC_connector (162 pins), U_ADC (33 pins), Supply (60 pins), Clock_Distribution (60 pins), U_ADC (33 pins), U_ADC (33 pins), U_ADC (33 pins), ADC_Buffers (99 pins), Triggers (10 pins)
P1V8_AVDD1: U_ADC (L4A.1), Supply (7 pins), U_ADC (L4B.1)
P1V8_AVDD2: Supply (7 pins), U_ADC (L4C.1), U_ADC (L4D.1)
P1V8_OVDD: FMC_ADC_top (C25.1 C129.2 IC18.1 IC19.1), U_ADC (L5A.2), Supply (7 pins), U_ADC (L5B.2), U_ADC (L5C.2), U_ADC (L5D.2)
P3V3: FMC_connector (5 pins), Supply (5 pins)
P3V3_BUF: Supply (5 pins), ADC_Buffers (126 pins)
P3V3CLK: Supply (5 pins), Clock_Distribution (46 pins)
P3V3D: EEPROM_Temp_LEDs (7 pins), Supply (C77.1 L6.2 P3V3D.1), Triggers (5 pins)
P12V0: FMC_connector (J6.c35 J6.c37), Supply (6 pins)
VADJ: FMC_ADC_top (6 pins), FMC_connector (8 pins), Clock_Distribution (IC26.2)
ADC1_CLK_N: U_ADC (C19A.1), Clock_Distribution (IC2.34 R20.1)
ADC1_CLK_P: U_ADC (C8A.1), Clock_Distribution (IC2.35 R19.1)
ADC2_CLK_N: Clock_Distribution (IC2.28 R23.1), U_ADC (C19B.1)
ADC2_CLK_P: Clock_Distribution (IC2.29 R21.1), U_ADC (C8B.1)
ADC3_CLK_N: Clock_Distribution (IC2.53 R18.1), U_ADC (C19C.1)
ADC3_CLK_P: Clock_Distribution (IC2.54 R17.1), U_ADC (C8C.1)
ADC4_CLK_N: Clock_Distribution (IC2.57 R15.1), U_ADC (C19D.1)
ADC4_CLK_P: Clock_Distribution (IC2.58 R14.1), U_ADC (C8D.1)
ADC_BUF_CSB0: FMC_ADC_top (IC18.5), U_ADC (IC1A.67)
ADC_BUF_CSB1: FMC_ADC_top (IC18.6), U_ADC (IC1B.67)
ADC_BUF_CSB2: FMC_ADC_top (IC18.7), U_ADC (IC1C.67)
ADC_BUF_CSB3: FMC_ADC_top (IC18.8), U_ADC (IC1D.67)
ADC_BUF_DATA0.CLKOUT_N: FMC_connector (J6.f5), ADC_Buffers (IC5.31)
ADC_BUF_DATA0.CLKOUT_P: FMC_connector (J6.f4), ADC_Buffers (IC5.32)
ADC_BUF_DATA0.D0_N: FMC_connector (J6.e3), ADC_Buffers (IC6.26)
ADC_BUF_DATA0.D0_P: FMC_connector (J6.e2), ADC_Buffers (IC6.25)
ADC_BUF_DATA0.D2_N: FMC_connector (J6.f8), ADC_Buffers (IC6.29)
ADC_BUF_DATA0.D2_P: FMC_connector (J6.f7), ADC_Buffers (IC6.30)
ADC_BUF_DATA0.D4_N: FMC_connector (J6.e7), ADC_Buffers (IC6.27)
ADC_BUF_DATA0.D4_P: FMC_connector (J6.e6), ADC_Buffers (IC6.28)
ADC_BUF_DATA0.D6_N: FMC_connector (J6.e10), ADC_Buffers (IC6.32)
ADC_BUF_DATA0.D6_P: FMC_connector (J6.e9), ADC_Buffers (IC6.31)
ADC_BUF_DATA0.D8_N: FMC_connector (J6.j7), ADC_Buffers (IC5.29)
ADC_BUF_DATA0.D8_P: FMC_connector (J6.j6), ADC_Buffers (IC5.30)
ADC_BUF_DATA0.D10_N: FMC_connector (J6.k8), ADC_Buffers (IC5.27)
ADC_BUF_DATA0.D10_P: FMC_connector (J6.k7), ADC_Buffers (IC5.28)
ADC_BUF_DATA0.D12_N: FMC_connector (J6.j10), ADC_Buffers (IC5.25)
ADC_BUF_DATA0.D12_P: FMC_connector (J6.j9), ADC_Buffers (IC5.26)
ADC_BUF_DATA0.D14_N: FMC_connector (J6.k11), ADC_Buffers (IC7.26)
ADC_BUF_DATA0.D14_P: FMC_connector (J6.k10), ADC_Buffers (IC7.25)
ADC_BUF_DATA1.CLKOUT_N: FMC_connector (J6.d9), ADC_Buffers (IC8.29)
ADC_BUF_DATA1.CLKOUT_P: FMC_connector (J6.d8), ADC_Buffers (IC8.30)
ADC_BUF_DATA1.D0_N: FMC_connector (J6.h11), ADC_Buffers (IC7.28)
ADC_BUF_DATA1.D0_P: FMC_connector (J6.h10), ADC_Buffers (IC7.27)
ADC_BUF_DATA1.D2_N: FMC_connector (J6.g10), ADC_Buffers (IC7.30)
ADC_BUF_DATA1.D2_P: FMC_connector (J6.g9), ADC_Buffers (IC7.29)
ADC_BUF_DATA1.D4_N: FMC_connector (J6.g13), ADC_Buffers (IC7.32)
ADC_BUF_DATA1.D4_P: FMC_connector (J6.g12), ADC_Buffers (IC7.31)
ADC_BUF_DATA1.D6_N: FMC_connector (J6.h14), ADC_Buffers (IC8.31)
ADC_BUF_DATA1.D6_P: FMC_connector (J6.h13), ADC_Buffers (IC8.32)
ADC_BUF_DATA1.D8_N: FMC_connector (J6.g16), ADC_Buffers (IC8.27)
ADC_BUF_DATA1.D8_P: FMC_connector (J6.g15), ADC_Buffers (IC8.28)
ADC_BUF_DATA1.D10_N: FMC_connector (J6.d18), ADC_Buffers (IC8.25)
ADC_BUF_DATA1.D10_P: FMC_connector (J6.d17), ADC_Buffers (IC8.26)
ADC_BUF_DATA1.D12_N: FMC_connector (J6.h17), ADC_Buffers (IC9.26)
ADC_BUF_DATA1.D12_P: FMC_connector (J6.h16), ADC_Buffers (IC9.25)
ADC_BUF_DATA1.D14_N: FMC_connector (J6.g19), ADC_Buffers (IC9.28)
ADC_BUF_DATA1.D14_P: FMC_connector (J6.g18), ADC_Buffers (IC9.27)
ADC_BUF_DATA2.CLKOUT_N: FMC_connector (J6.c23), ADC_Buffers (IC12.27)
ADC_BUF_DATA2.CLKOUT_P: FMC_connector (J6.c22), ADC_Buffers (IC12.28)
ADC_BUF_DATA2.D0_N: FMC_connector (J6.d21), ADC_Buffers (IC9.30)
ADC_BUF_DATA2.D0_P: FMC_connector (J6.d20), ADC_Buffers (IC9.29)
ADC_BUF_DATA2.D2_N: FMC_connector (J6.g22), ADC_Buffers (IC9.32)
ADC_BUF_DATA2.D2_P: FMC_connector (J6.g21), ADC_Buffers (IC9.31)
ADC_BUF_DATA2.D4_N: FMC_connector (J6.d24), ADC_Buffers (IC12.31)
ADC_BUF_DATA2.D4_P: FMC_connector (J6.d23), ADC_Buffers (IC12.32)
ADC_BUF_DATA2.D6_N: FMC_connector (J6.h23), ADC_Buffers (IC12.29)
ADC_BUF_DATA2.D6_P: FMC_connector (J6.h22), ADC_Buffers (IC12.30)
ADC_BUF_DATA2.D8_N: FMC_connector (J6.g25), ADC_Buffers (IC12.25)
ADC_BUF_DATA2.D8_P: FMC_connector (J6.g24), ADC_Buffers (IC12.26)
ADC_BUF_DATA2.D10_N: FMC_connector (J6.h26), ADC_Buffers (IC10.26)
ADC_BUF_DATA2.D10_P: FMC_connector (J6.h25), ADC_Buffers (IC10.25)
ADC_BUF_DATA2.D12_N: FMC_connector (J6.g28), ADC_Buffers (IC10.30)
ADC_BUF_DATA2.D12_P: FMC_connector (J6.g27), ADC_Buffers (IC10.29)
ADC_BUF_DATA2.D14_N: FMC_connector (J6.d27), ADC_Buffers (IC10.28)
ADC_BUF_DATA2.D14_P: FMC_connector (J6.d26), ADC_Buffers (IC10.27)
ADC_BUF_DATA3.CLKOUT_N: FMC_connector (J6.k29), ADC_Buffers (IC13.25)
ADC_BUF_DATA3.CLKOUT_P: FMC_connector (J6.k28), ADC_Buffers (IC13.26)
ADC_BUF_DATA3.D0_N: FMC_connector (J6.k26), ADC_Buffers (IC10.32)
ADC_BUF_DATA3.D0_P: FMC_connector (J6.k25), ADC_Buffers (IC10.31)
ADC_BUF_DATA3.D2_N: FMC_connector (J6.j31), ADC_Buffers (IC13.31)
ADC_BUF_DATA3.D2_P: FMC_connector (J6.j30), ADC_Buffers (IC13.32)
ADC_BUF_DATA3.D4_N: FMC_connector (J6.f32), ADC_Buffers (IC13.29)
ADC_BUF_DATA3.D4_P: FMC_connector (J6.f31), ADC_Buffers (IC13.30)
ADC_BUF_DATA3.D6_N: FMC_connector (J6.k32), ADC_Buffers (IC13.27)
ADC_BUF_DATA3.D6_P: FMC_connector (J6.k31), ADC_Buffers (IC13.28)
ADC_BUF_DATA3.D8_N: FMC_connector (J6.j34), ADC_Buffers (IC11.26)
ADC_BUF_DATA3.D8_P: FMC_connector (J6.j33), ADC_Buffers (IC11.25)
ADC_BUF_DATA3.D10_N: FMC_connector (J6.k35), ADC_Buffers (IC11.28)
ADC_BUF_DATA3.D10_P: FMC_connector (J6.k34), ADC_Buffers (IC11.27)
ADC_BUF_DATA3.D12_N: FMC_connector (J6.j37), ADC_Buffers (IC11.30)
ADC_BUF_DATA3.D12_P: FMC_connector (J6.j36), ADC_Buffers (IC11.29)
ADC_BUF_DATA3.D14_N: FMC_connector (J6.k38), ADC_Buffers (IC11.32)
ADC_BUF_DATA3.D14_P: FMC_connector (J6.k37), ADC_Buffers (IC11.31)
ADC_BUF_RESETn: FMC_ADC_top (IC18.10), U_ADC (IC1A.18), U_ADC (IC1B.18), U_ADC (IC1C.18), U_ADC (IC1D.18)
ADC_BUF_SCLK: FMC_ADC_top (IC18.4), U_ADC (IC1A.68), U_ADC (IC1B.68), U_ADC (IC1C.68), U_ADC (IC1D.68)
ADC_BUF_SDI: FMC_ADC_top (IC18.3), U_ADC (IC1A.69), U_ADC (IC1B.69), U_ADC (IC1C.69), U_ADC (IC1D.69)
ADC_BUF_SDO: FMC_ADC_top (IC19.3), U_ADC (IC1A.66), U_ADC (IC1B.66), U_ADC (IC1C.66), U_ADC (IC1D.66)
ADC_BUF_SLEEP: FMC_ADC_top (IC18.9), U_ADC (IC1A.3), U_ADC (IC1B.3), U_ADC (IC1C.3), U_ADC (IC1D.3)
ADC_CSB0: FMC_ADC_top (IC18.19), FMC_connector (J6.c15)
ADC_CSB1: FMC_ADC_top (IC18.18), FMC_connector (J6.d15)
ADC_CSB2: FMC_ADC_top (IC18.17), FMC_connector (J6.c14)
ADC_CSB3: FMC_ADC_top (IC18.16), FMC_connector (J6.d14)
ADC_DATA0.CLKOUT_N: U_ADC (IC1A.47), ADC_Buffers (IC5.10)
ADC_DATA0.CLKOUT_P: U_ADC (IC1A.48), ADC_Buffers (IC5.9)
ADC_DATA0.D0_N: U_ADC (IC1A.63), ADC_Buffers (IC6.15)
ADC_DATA0.D0_P: U_ADC (IC1A.64), ADC_Buffers (IC6.16)
ADC_DATA0.D2_N: U_ADC (IC1A.59), ADC_Buffers (IC6.12)
ADC_DATA0.D2_P: U_ADC (IC1A.60), ADC_Buffers (IC6.11)
ADC_DATA0.D4_N: U_ADC (IC1A.55), ADC_Buffers (IC6.14)
ADC_DATA0.D4_P: U_ADC (IC1A.56), ADC_Buffers (IC6.13)
ADC_DATA0.D6_N: U_ADC (IC1A.51), ADC_Buffers (IC6.9)
ADC_DATA0.D6_P: U_ADC (IC1A.52), ADC_Buffers (IC6.10)
ADC_DATA0.D8_N: U_ADC (IC1A.43), ADC_Buffers (IC5.12)
ADC_DATA0.D8_P: U_ADC (IC1A.44), ADC_Buffers (IC5.11)
ADC_DATA0.D10_N: U_ADC (IC1A.39), ADC_Buffers (IC5.14)
ADC_DATA0.D10_P: U_ADC (IC1A.40), ADC_Buffers (IC5.13)
ADC_DATA0.D12_N: U_ADC (IC1A.35), ADC_Buffers (IC5.16)
ADC_DATA0.D12_P: U_ADC (IC1A.36), ADC_Buffers (IC5.15)
ADC_DATA0.D14_N: U_ADC (IC1A.30), ADC_Buffers (IC7.15)
ADC_DATA0.D14_P: U_ADC (IC1A.31), ADC_Buffers (IC7.16)
ADC_DATA1.CLKOUT_N: U_ADC (IC1B.47), ADC_Buffers (IC8.12)
ADC_DATA1.CLKOUT_P: U_ADC (IC1B.48), ADC_Buffers (IC8.11)
ADC_DATA1.D0_N: U_ADC (IC1B.63), ADC_Buffers (IC7.13)
ADC_DATA1.D0_P: U_ADC (IC1B.64), ADC_Buffers (IC7.14)
ADC_DATA1.D2_N: U_ADC (IC1B.59), ADC_Buffers (IC7.11)
ADC_DATA1.D2_P: U_ADC (IC1B.60), ADC_Buffers (IC7.12)
ADC_DATA1.D4_N: U_ADC (IC1B.55), ADC_Buffers (IC7.9)
ADC_DATA1.D4_P: U_ADC (IC1B.56), ADC_Buffers (IC7.10)
ADC_DATA1.D6_N: U_ADC (IC1B.51), ADC_Buffers (IC8.10)
ADC_DATA1.D6_P: U_ADC (IC1B.52), ADC_Buffers (IC8.9)
ADC_DATA1.D8_N: U_ADC (IC1B.43), ADC_Buffers (IC8.14)
ADC_DATA1.D8_P: U_ADC (IC1B.44), ADC_Buffers (IC8.13)
ADC_DATA1.D10_N: U_ADC (IC1B.39), ADC_Buffers (IC8.16)
ADC_DATA1.D10_P: U_ADC (IC1B.40), ADC_Buffers (IC8.15)
ADC_DATA1.D12_N: U_ADC (IC1B.35), ADC_Buffers (IC9.15)
ADC_DATA1.D12_P: U_ADC (IC1B.36), ADC_Buffers (IC9.16)
ADC_DATA1.D14_N: U_ADC (IC1B.30), ADC_Buffers (IC9.13)
ADC_DATA1.D14_P: U_ADC (IC1B.31), ADC_Buffers (IC9.14)
ADC_DATA2.CLKOUT_N: U_ADC (IC1C.47), ADC_Buffers (IC12.14)
ADC_DATA2.CLKOUT_P: U_ADC (IC1C.48), ADC_Buffers (IC12.13)
ADC_DATA2.D0_N: U_ADC (IC1C.63), ADC_Buffers (IC9.11)
ADC_DATA2.D0_P: U_ADC (IC1C.64), ADC_Buffers (IC9.12)
ADC_DATA2.D2_N: U_ADC (IC1C.59), ADC_Buffers (IC9.9)
ADC_DATA2.D2_P: U_ADC (IC1C.60), ADC_Buffers (IC9.10)
ADC_DATA2.D4_N: U_ADC (IC1C.55), ADC_Buffers (IC12.10)
ADC_DATA2.D4_P: U_ADC (IC1C.56), ADC_Buffers (IC12.9)
ADC_DATA2.D6_N: U_ADC (IC1C.51), ADC_Buffers (IC12.12)
ADC_DATA2.D6_P: U_ADC (IC1C.52), ADC_Buffers (IC12.11)
ADC_DATA2.D8_N: U_ADC (IC1C.43), ADC_Buffers (IC12.16)
ADC_DATA2.D8_P: U_ADC (IC1C.44), ADC_Buffers (IC12.15)
ADC_DATA2.D10_N: U_ADC (IC1C.39), ADC_Buffers (IC10.15)
ADC_DATA2.D10_P: U_ADC (IC1C.40), ADC_Buffers (IC10.16)
ADC_DATA2.D12_N: U_ADC (IC1C.35), ADC_Buffers (IC10.11)
ADC_DATA2.D12_P: U_ADC (IC1C.36), ADC_Buffers (IC10.12)
ADC_DATA2.D14_N: U_ADC (IC1C.30), ADC_Buffers (IC10.13)
ADC_DATA2.D14_P: U_ADC (IC1C.31), ADC_Buffers (IC10.14)
ADC_DATA3.CLKOUT_N: U_ADC (IC1D.47), ADC_Buffers (IC13.16)
ADC_DATA3.CLKOUT_P: U_ADC (IC1D.48), ADC_Buffers (IC13.15)
ADC_DATA3.D0_N: U_ADC (IC1D.63), ADC_Buffers (IC10.9)
ADC_DATA3.D0_P: U_ADC (IC1D.64), ADC_Buffers (IC10.10)
ADC_DATA3.D2_N: U_ADC (IC1D.59), ADC_Buffers (IC13.10)
ADC_DATA3.D2_P: U_ADC (IC1D.60), ADC_Buffers (IC13.9)
ADC_DATA3.D4_N: U_ADC (IC1D.55), ADC_Buffers (IC13.12)
ADC_DATA3.D4_P: U_ADC (IC1D.56), ADC_Buffers (IC13.11)
ADC_DATA3.D6_N: U_ADC (IC1D.51), ADC_Buffers (IC13.14)
ADC_DATA3.D6_P: U_ADC (IC1D.52), ADC_Buffers (IC13.13)
ADC_DATA3.D8_N: U_ADC (IC1D.43), ADC_Buffers (IC11.15)
ADC_DATA3.D8_P: U_ADC (IC1D.44), ADC_Buffers (IC11.16)
ADC_DATA3.D10_N: U_ADC (IC1D.39), ADC_Buffers (IC11.13)
ADC_DATA3.D10_P: U_ADC (IC1D.40), ADC_Buffers (IC11.14)
ADC_DATA3.D12_N: U_ADC (IC1D.35), ADC_Buffers (IC11.11)
ADC_DATA3.D12_P: U_ADC (IC1D.36), ADC_Buffers (IC11.12)
ADC_DATA3.D14_N: U_ADC (IC1D.30), ADC_Buffers (IC11.9)
ADC_DATA3.D14_P: U_ADC (IC1D.31), ADC_Buffers (IC11.10)
ADC_RESETn: FMC_ADC_top (IC18.14), FMC_connector (J6.e12)
ADC_SCLK: FMC_ADC_top (IC18.20), FMC_connector (J6.c18)
ADC_SDI: FMC_ADC_top (IC18.21), FMC_connector (J6.c19)
ADC_SDO: FMC_ADC_top (IC19.4), FMC_connector (J6.d12)
ADC_SLEEP: FMC_ADC_top (IC18.15), FMC_connector (J6.f14)
CLK_SEL: FMC_connector (J6.j22), Clock_Distribution (IC4.6 R44.1)
CLKDIVRST_N: FMC_ADC_top (R3.1), FMC_connector (J6.h38), U_ADC (IC1A.25), U_ADC (IC1B.25), U_ADC (IC1C.25), U_ADC (IC1D.25)
CLKDIVRST_P: FMC_ADC_top (R3.2), FMC_connector (J6.h37), U_ADC (IC1A.24), U_ADC (IC1B.24), U_ADC (IC1C.24), U_ADC (IC1D.24)
FMC_CLK_N: FMC_connector (J6.k5), Clock_Distribution (C51.2 R45.2)
FMC_CLK_P: FMC_connector (J6.k4), Clock_Distribution (C16.2 R45.1)
FPGA_CLK_N: FMC_connector (J6.h5), Clock_Distribution (IC2.24)
FPGA_CLK_P: FMC_connector (J6.h4), Clock_Distribution (IC2.25)
GA0: EEPROM_Temp_LEDs (IC22.2), FMC_connector (J6.c34)
GA1: EEPROM_Temp_LEDs (IC22.1), FMC_connector (J6.d35)
IN1: FMC_ADC_top (J1.1), U_ADC (C7A.2)
IN2: FMC_ADC_top (J2.1), U_ADC (C7B.2)
IN3: FMC_ADC_top (J8.1), U_ADC (C7C.2)
IN4: FMC_ADC_top (J9.1), U_ADC (C7D.2)
IPTAT1: EEPROM_Temp_LEDs (R32.2), U_ADC (IC1A.16)
IPTAT2: EEPROM_Temp_LEDs (R33.2), U_ADC (IC1B.16)
IPTAT3: EEPROM_Temp_LEDs (R34.2), U_ADC (IC1C.16)
IPTAT4: EEPROM_Temp_LEDs (R35.2), U_ADC (IC1D.16)
LA24_N: EEPROM_Temp_LEDs (Q1.5), FMC_connector (J6.h29)
LA24_P: EEPROM_Temp_LEDs (Q2.2), FMC_connector (J6.h28)
LA28_N: EEPROM_Temp_LEDs (IC15.2), FMC_connector (J6.h32)
LA29_P: EEPROM_Temp_LEDs (Q1.2), FMC_connector (J6.g30)
LA30_N: EEPROM_Temp_LEDs (IC15.35), FMC_connector (J6.h35)
LA30_P: EEPROM_Temp_LEDs (R46.1), FMC_connector (J6.h34)
LA31_N: EEPROM_Temp_LEDs (IC15.33), FMC_connector (J6.g34)
LA31_P: EEPROM_Temp_LEDs (IC15.32), FMC_connector (J6.g33)
LA33_N: FMC_connector (J6.g37), Triggers (IC20.7 R50.1)
LA33_P: FMC_connector (J6.g36), Triggers (IC20.6 R50.2)
NetC9A_2: FMC_ADC_top (J1.2), U_ADC (C9A.2 C54A.2 C55A.1 R41A.2)
NetC9B_2: FMC_ADC_top (J2.2), U_ADC (C9B.2 C54B.2 C55B.1 R41B.2)
NetC9C_2: FMC_ADC_top (J8.2), U_ADC (C9C.2 C54C.2 C55C.1 R41C.2)
NetC9D_2: FMC_ADC_top (J9.2), U_ADC (C9D.2 C54D.2 C55D.1 R41D.2)
PLL_FUNCTION: FMC_connector (J6.j19), Clock_Distribution (IC2.16)
PLL_SCB: FMC_connector (J6.k19), Clock_Distribution (IC2.21)
PLL_SCLK: FMC_connector (J6.j21), Clock_Distribution (IC2.18)
PLL_SDIO: FMC_connector (D4.2 J6.k20), Clock_Distribution (R51.1)
PLL_SDO: FMC_connector (D6.2 J6.k22), Clock_Distribution (R52.1)
PLL_STATUS: FMC_connector (D5.2 J6.j18), Clock_Distribution (R53.1)
SCL: EEPROM_Temp_LEDs (IC22.6), FMC_connector (J6.c30)
SDA: EEPROM_Temp_LEDs (IC22.5), FMC_connector (J6.c31)
Si_OE: FMC_connector (R75.2), Clock_Distribution (OSC2.2)
Si_SCL: FMC_connector (J6.c10), Clock_Distribution (IC26.3)
Si_SDA: FMC_connector (J6.c11), Clock_Distribution (IC26.4)
TRIG_DIR: FMC_connector (J6.c26), Triggers (IC20.2 IC20.3 Q3.2)
TRIG_TERM: FMC_connector (J6.c27), Triggers (Q2.5 Q3.5 R49.2)

## Assembly variants
active clock: not fitted R24
passive clock: all parts fitted
active clock_GSI: not fitted J7 J10 R24
active_clock_LNLS: not fitted R41A R41B R41C R41D